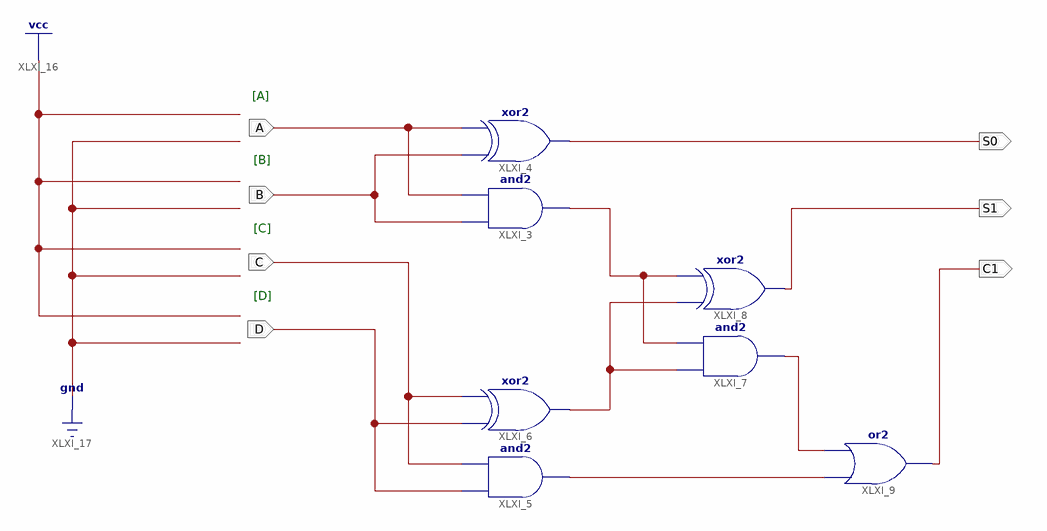
[diagram p0: schematic sheet 1]
// Xilinx ISE schematic LAB06_02.sch (spartan6) as structural Verilog: 7 symbols, 7 ports
module LAB06_02 (
  input  B,
  input  C,
  input  D,
  input  A,
  output S0,
  output C1,
  output S1
);

  wire XLXN_5, XLXN_26, XLXN_28, XLXN_31;

  and XLXI_3 (XLXN_31, B, A);
  xor XLXI_4 (S0, B, A);
  and XLXI_5 (XLXN_28, D, C);
  xor XLXI_6 (XLXN_5, D, C);
  or XLXI_9 (C1, XLXN_28, XLXN_26);
  and XLXI_7 (XLXN_26, XLXN_5, XLXN_31);
  xor XLXI_8 (S1, XLXN_5, XLXN_31);

  // Notes on the sheet:
  //   [A]
  //   [B]
  //   [C]
  //   [D]
endmodule
